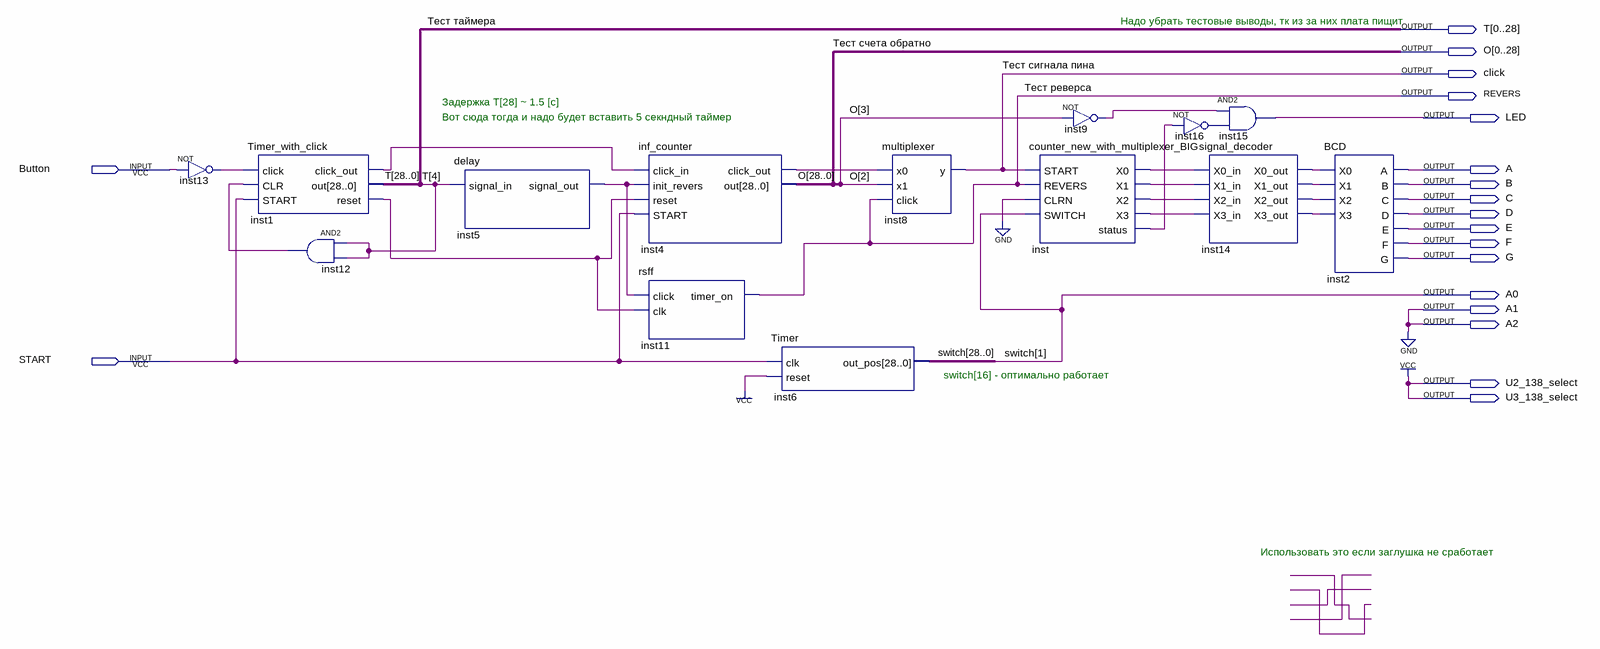
[diagram p0: schematic sheet]
// Quartus schematic my_counter_click_new.bdf as structural Verilog: 14 symbols, 19 pins
module my_counter_click_new (
  input  Button,
  input  START,
  output [0:28] T,
  output [0:28] O,
  output click,
  output REVERS,
  output LED,
  output A,
  output B,
  output C,
  output D,
  output E,
  output F,
  output G,
  output A0,
  output A1,
  output A2,
  output U2_138_select,
  output U3_138_select
);

  wire inst1_click_out, inst1_reset, inst4_click_out, inst5_signal_out, inst9_out, inst12_out, inst13_out,
       inst14_x0_out, inst14_x1_out, inst14_x2_out, inst14_x3_out, inst16_out, inst_status, inst_x0, inst_x1,
       inst_x2, inst_x3;
  wire [28:0] switch;

  not inst13 (inst13_out, Button);
  Timer_with_click inst1 (
    .click(inst13_out), .CLR(inst12_out), .START(START), .click_out(inst1_click_out),
    .out({T[28], T[27], T[26], T[25], T[24], T[23], T[22], T[21], T[20], T[19], T[18], T[17], T[16], T[15], T[14], T[13], T[12], T[11], T[10], T[9], T[8], T[7], T[6], T[5], T[4], T[3], T[2], T[1], T[0]}),
    .reset(inst1_reset));
  and inst12 (inst12_out, T[4], T[4]);
  delay inst5 (.signal_in(T[4]), .signal_out(inst5_signal_out));
  inf_counter inst4 (
    .click_in(inst1_click_out), .init_revers(inst5_signal_out), .reset(inst1_reset), .START(START),
    .click_out(inst4_click_out),
    .out({O[28], O[27], O[26], O[25], O[24], O[23], O[22], O[21], O[20], O[19], O[18], O[17], O[16], O[15], O[14], O[13], O[12], O[11], O[10], O[9], O[8], O[7], O[6], O[5], O[4], O[3], O[2], O[1], O[0]}));
  rsff inst11 (.click(inst5_signal_out), .clk(inst1_reset), .timer_on(REVERS));
  Timer inst6 (.clk(START), .reset(1'b1), .out_pos({switch[28:2], A0, switch[0]}));
  multiplexer inst8 (.x0(inst4_click_out), .x1(O[2]), .click(REVERS), .y(click));
  counter_new_with_multiplexer_BIG inst (
    .START(click), .REVERS(REVERS), .CLRN(1'b0), .SWITCH(A0), .X0(inst_x0), .X1(inst_x1), .X2(inst_x2),
    .X3(inst_x3), .status(inst_status));
  not inst9 (inst9_out, O[3]);
  not inst16 (inst16_out, inst_status);
  and inst15 (LED, inst9_out, inst16_out);
  signal_decoder inst14 (
    .X0_in(inst_x0), .X1_in(inst_x1), .X2_in(inst_x2), .X3_in(inst_x3), .X0_out(inst14_x0_out),
    .X1_out(inst14_x1_out), .X2_out(inst14_x2_out), .X3_out(inst14_x3_out));
  BCD inst2 (
    .X0(inst14_x0_out), .X1(inst14_x1_out), .X2(inst14_x2_out), .X3(inst14_x3_out), .A(A), .B(B), .C(C),
    .D(D), .E(E), .F(F), .G(G));

  assign A1 = 1'b0;
  assign A2 = 1'b0;
  assign U2_138_select = 1'b1;
  assign U3_138_select = 1'b1;

  // Other names for the same wires on the sheet: switch[1] = A0

  // Notes on the sheet:
  //   Тест таймера
  //   Надо убрать тестовые выводы, тк из за них плата пищит
  //   Тест счета обратно
  //   Тест сигнала пина
  //   Тест реверса
  //   Задержка Т[28] ~ 1.5 [c]
  //   Вот сюда тогда и надо будет вставить 5 секндный таймер
  //   switch[16] - оптимально работает
  //   Использовать это если заглушка не сработает
endmodule
